# Altium schematic sheet fpga.SchDoc
size A4
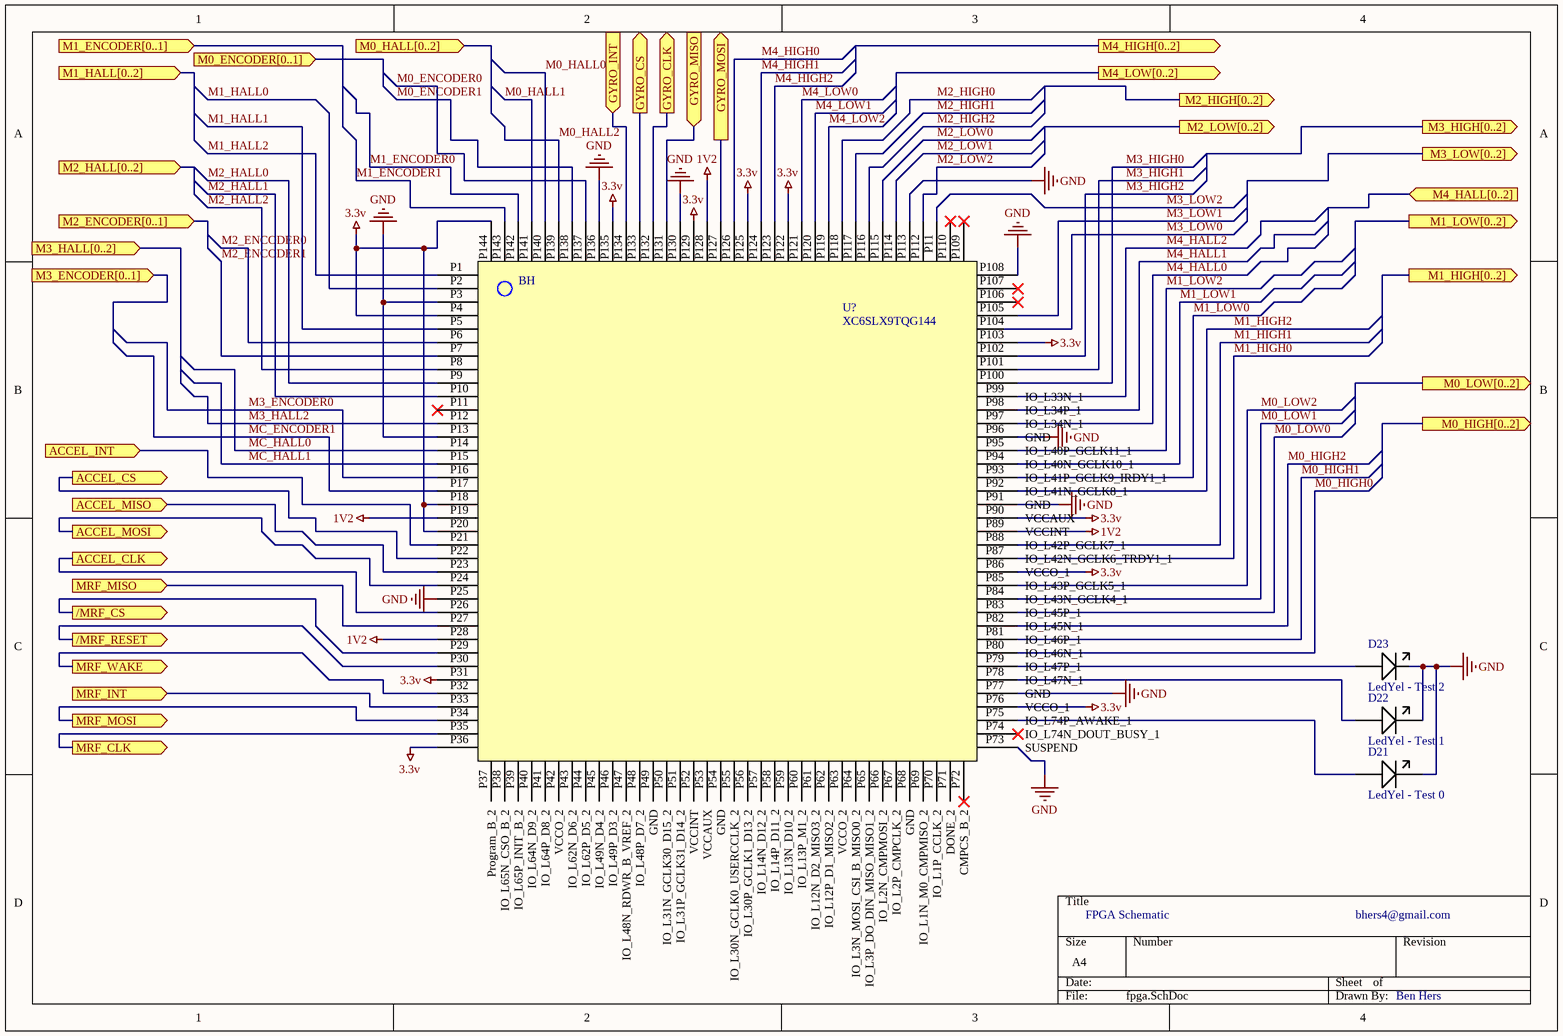
[diagram p0: fpga.SchDoc]

## Parts
D21  LedYel - Test 0  [1206]
D22  LedYel - Test 1  [1206]
D23  LedYel - Test 2  [1206]
U?  XC6SLX9TQG144  [fpgaTQ144fpgaXC6SLX9-3TQG144CfpgaPrimary)]

## Ports
/MRF_CS (out), /MRF_RESET (out), ACCEL_CLK (out), ACCEL_CS (out), ACCEL_INT (in), ACCEL_MISO (in), ACCEL_MOSI (out), GYRO_CLK (out), GYRO_CS (out), GYRO_INT (in), GYRO_MISO (in), GYRO_MOSI (out), M0_ENCODER[0..1] (in), M0_HALL[0..2] (in), M0_HIGH[0..2] (out), M0_LOW[0..2] (out), M1_ENCODER[0..1] (in), M1_HALL[0..2] (in), M1_HIGH[0..2] (out), M1_LOW[0..2] (out), M2_ENCODER[0..1] (in), M2_HALL[0..2] (in), M2_HIGH[0..2] (out), M2_LOW[0..2] (out), M3_ENCODER[0..1] (in), M3_HALL[0..2] (in), M3_HIGH[0..2] (out), M3_LOW[0..2] (out), M4_HALL[0..2] (in), M4_HIGH[0..2] (out), M4_LOW[0..2] (out), MRF_CLK (out), MRF_INT (in), MRF_MISO (in), MRF_MOSI (out), MRF_WAKE (out)

## Nets
GND: D23.P2(-)

Not connected (* = marked no-connect by the designer): D21 P1(+) P2(-); D22 P1(+) P2(-); D23 P1(+); U? P1(IO_L83N_VREF_3) P2(IO_L83P_3) P3(GND) P4(VCCO_3) P5(IO_L52N_3) P6(IO_L52P_3) P7(IO_L51N_3) P8(IO_L51P_3) P9(IO_L50N_3) P10(IO_L50P_3) P11(IO_L49N_3) P12(IO_L49P_3) P13(GND) P14(IO_L44N_GCLK20_3) P15(IO_L44P_GCLK21_3) P16(IO_L43N_GCLK22_IRDY2_3) P17(IO_L43P_GCLK23_3) P18(VCC0_3) P19(VCCINT) P20(VCCAUX) P21(IO_L42N_GCLK24_3) P22(IO_L42P_GCLK25_TRDY2_3) P23(IO_L41N_GCLK26_3) P24(IO_L41P_GCLK27_3) P25(GND) P26(IO_L37N_3) P27(IO_L37P_3) P28(VCCINT) P29(IO_L36N_3) P30(IO_L36P_3) P31(VCCO_3) P32(IO_L2N_3) P33(IO_L2P_3) P34(IO_L1N_VREF_3) P35(IO_L1P_3) P36(VCCAUX) P37(Program_B_2) P38(IO_L65N_CSO_B_2) P39(IO_L65P_INIT_B_2) P40(IO_L64N_D9_2) P41(IO_L64P_D8_2) P42(VCCO_2) P43(IO_L62N_D6_2) P44(IO_L62P_D5_2) P45(IO_L49N_D4_2) P46(IO_L49P_D3_2) P47(IO_L48N_RDWR_B_VREF_2) P48(IO_L48P_D7_2) P49(GND) P50(IO_L31N_GCLK30_D15_2) P51(IO_L31P_GCLK31_D14_2) P52(VCCINT) P53(VCCAUX) P54(GND) P55(IO_L30N_GCLK0_USERCCLK_2) P56(IO_L30P_GCLK1_D13_2) P57(IO_L14N_D12_2) P58(IO_L14P_D11_2) P59(IO_L13N_D10_2) P60(IO_L13P_M1_2) P61(IO_L12N_D2_MISO3_2) P62(IO_L12P_D1_MISO2_2) P63(VCCO_2) P64(IO_L3N_MOSI_CSI_B_MISO0_2) P65(IO_L3P_DO_DIN_MISO_MISO1_2) P66(IO_L2N_CMPMOSI_2) P67(IO_L2P_CMPCLK_2) P68(GND) P69(IO_L1N_M0_CMPMISO_2) P70(IO_L1P_CCLK_2) P71(DONE_2) P72(CMPCS_B_2) P73(SUSPEND) P74(IO_L74N_DOUT_BUSY_1) P75(IO_L74P_AWAKE_1) P76(VCCO_1) P77(GND) P78(IO_L47N_1) P79(IO_L47P_1) P80(IO_L46N_1) P81(IO_L46P_1) P82(IO_L45N_1) P83(IO_L45P_1) P84(IO_L43N_GCLK4_1) P85(IO_L43P_GCLK5_1) P86(VCCO_1) P87(IO_L42N_GCLK6_TRDY1_1) P88(IO_L42P_GCLK7_1) P89(VCCINT) P90(VCCAUX) P91(GND) P92(IO_L41N_GCLK8_1) P93(IO_L41P_GCLK9_IRDY1_1) P94(IO_L40N_GCLK10_1) P95(IO_L40P_GCLK11_1) P96(GND) P97(IO_L34N_1) P98(IO_L34P_1) P99(IO_L33N_1) P100(IO_L33P_1) P101(IO_L32N_1) P102(IO_L32P_1) P103(VCCO_1) P104(IO_L1N_VREF_1) P105(IO_L1P_1) P106(TD0) P107(TMS) P108(GND) P109(TCK) P110(TDI) P112(IO_L66P_SCP1_0) P113(GND) P114(IO_L65N_SCP2_0) P115(IO_L65P_SCP3_0) P116(IO_L64N_SCP4_0) P117(IO_L64P_SCP5_0) P118(IO_L63N_SCP6_0) P119(IO_L63P_SCP7_0) P120(IO_L62N_VREF_0) P121(IO_L62P_0) P122(VCCO_0) P123(IO_L37N_GCLK12_0) P124(IO_L37P_GCLK13_0) P125(VCCO_0) P126(IO_L36N_GCLK14_0) P127(IO_L36P_GCLK15_0) P128(VCCINT) P129(VCCAUX) P130(GND) P131(IO_L35N_GCLK16_0) P132(IO_L35P_GCLK17_0) P133(IO_L34N_GCLK18_0) P134(IO_L34P_GCLK19_0) P135(VCCO_0) P136(GND) P137(IO_L4N_0) P138(IO_L4P_0) P139(IO_L3N_0) P140(IO_L3P_0) P141(IO_L2N_0) P142(IO_L2P_0) P143(IO_L1N_VREF_0) P144(IO_L1P_HSWAPEN_0)

## Notes on the sheet
- FPGA Schematic
- bhers4@gmail.com
- Ben Hers
- Labels drawn without touching a wire or pin: 3.3v, GND
- (in symbol Component_1) BH

## Library data of the parts
D21-D23 = LedYel
U? = Component_1